# Altium schematic sheet 05 - MCU.SchDoc
size A3; SheetNumber: 5; SheetTotal: 7
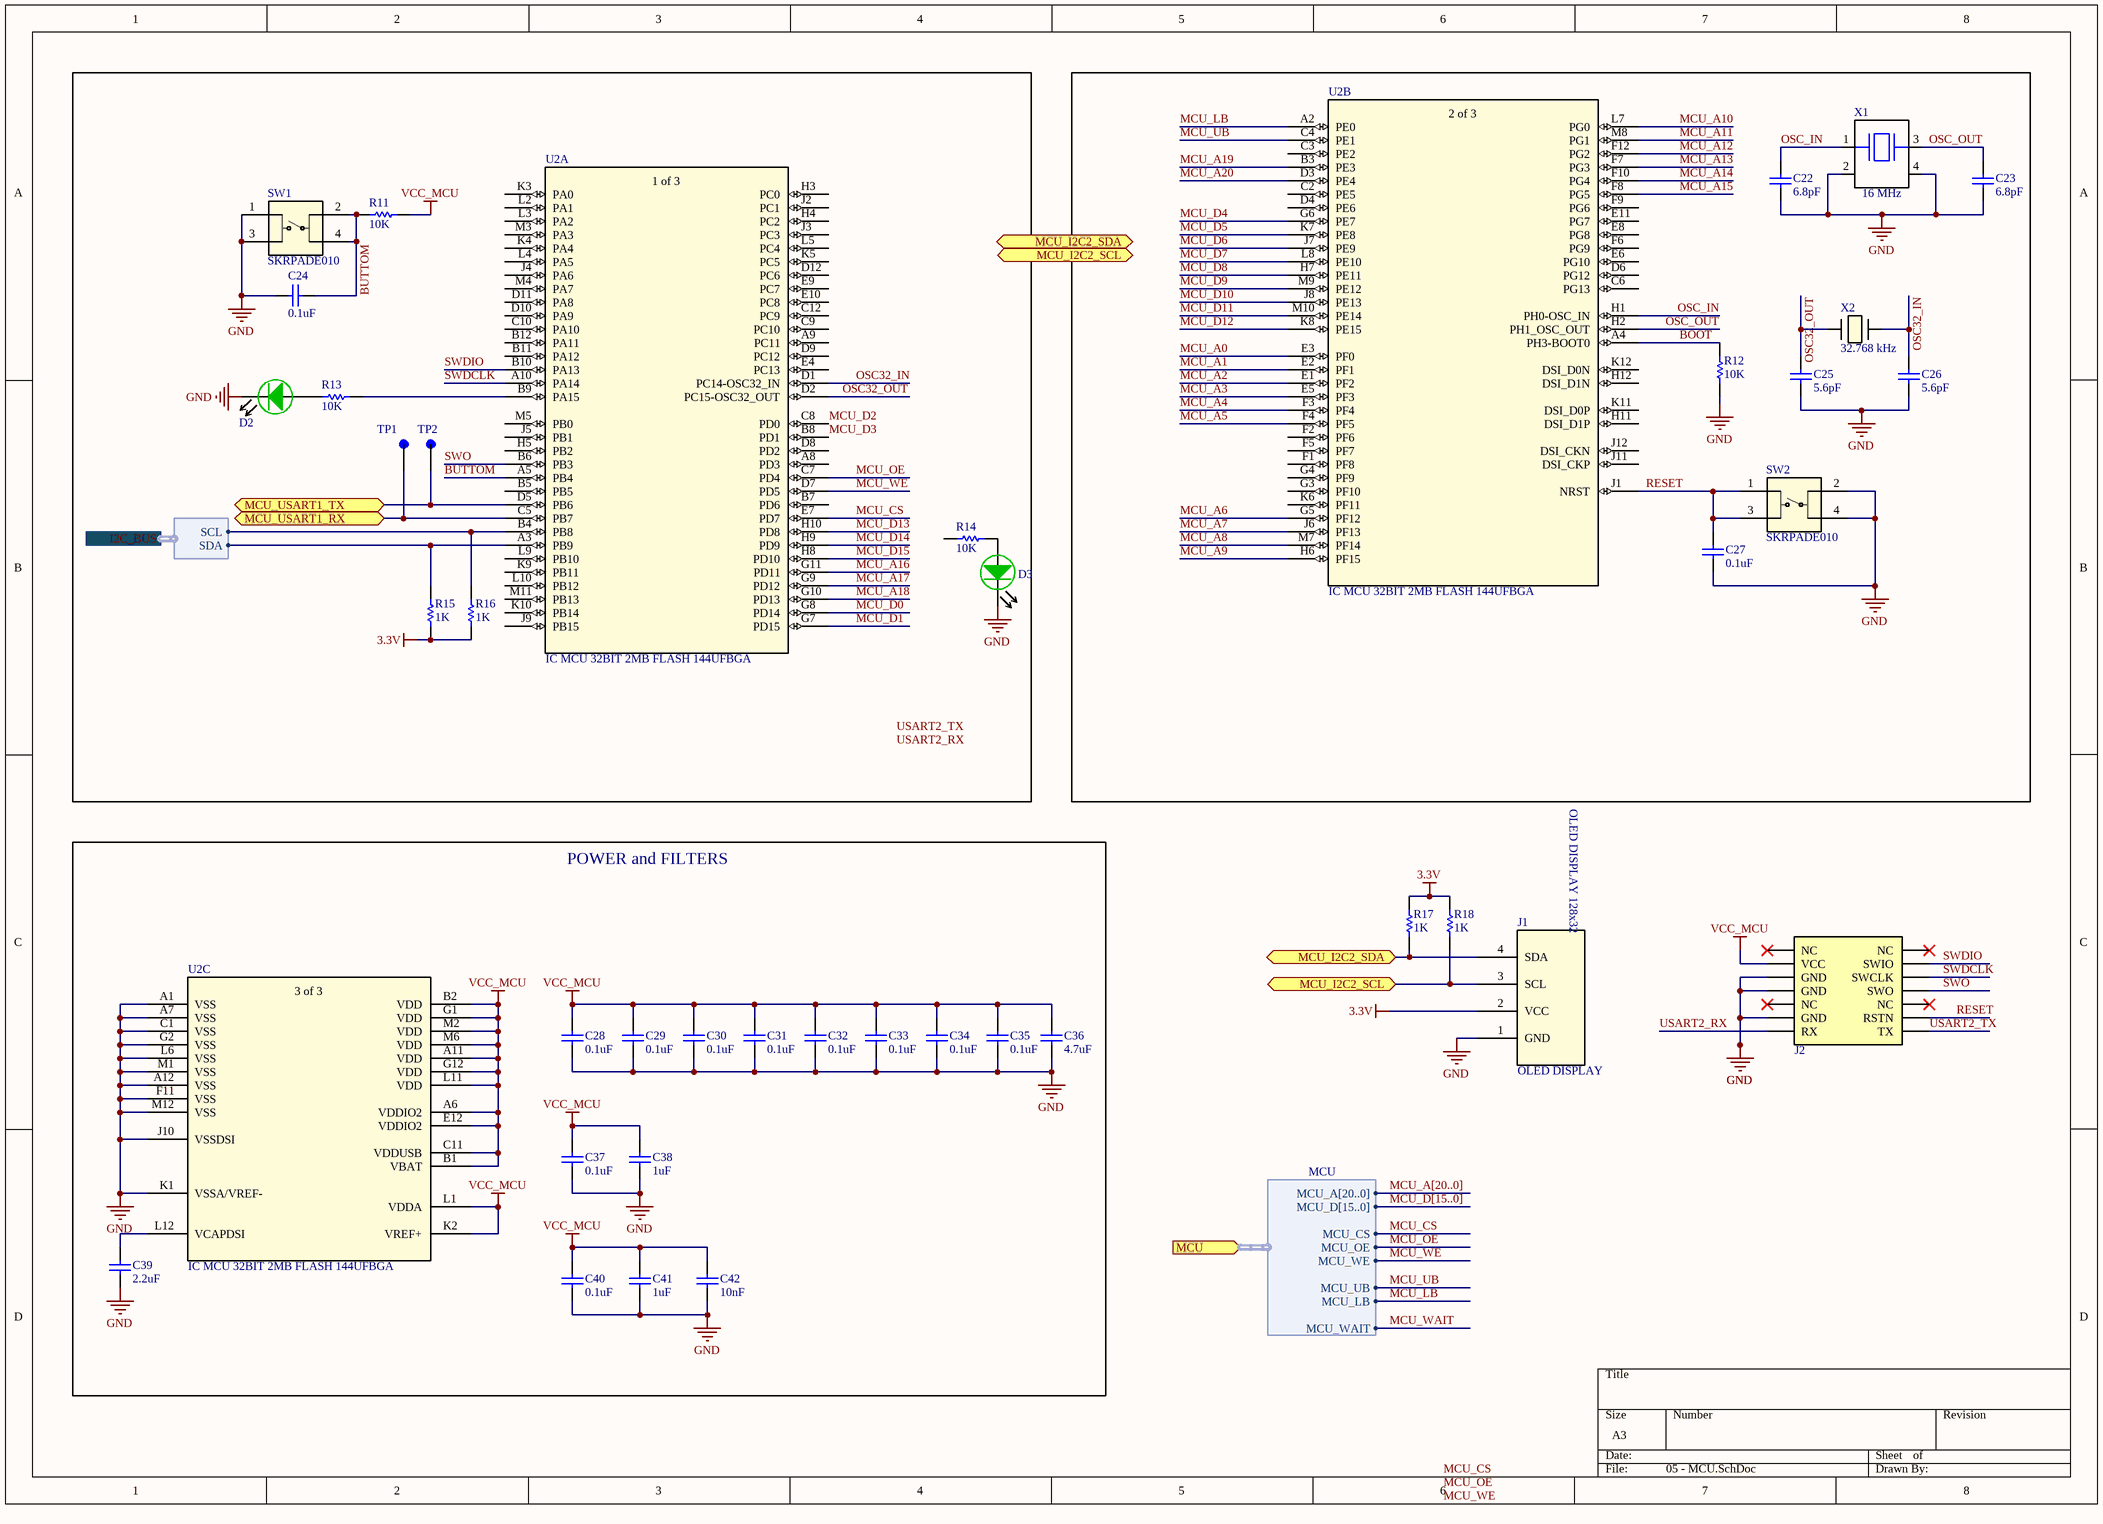
[diagram p0: 05 - MCU.SchDoc]

## Parts
C22  value 6.8pF  [0402-C-R]  (hidden comment: GRM0225C1E6R8CA03L)
C23  value 6.8pF  [0402-C-R]  (hidden comment: GRM0225C1E6R8CA03L)
C24  value 0.1uF  [0402-C-R]  (hidden comment: GRM155R61E104KA87D)
C25  value 5.6pF  [0402-C-R]  (hidden comment: CC0402BRNPO9BN5R6)
C26  value 5.6pF  [0402-C-R]  (hidden comment: CC0402BRNPO9BN5R6)
C27  value 0.1uF  [0402-C-R]  (hidden comment: GRM155R61E104KA87D)
C28  value 0.1uF  [0402-C-R]  (hidden comment: GRM155R61E104KA87D)
C29  value 0.1uF  [0402-C-R]  (hidden comment: GRM155R61E104KA87D)
C30  value 0.1uF  [0402-C-R]  (hidden comment: GRM155R61E104KA87D)
C31  value 0.1uF  [0402-C-R]  (hidden comment: GRM155R61E104KA87D)
C32  value 0.1uF  [0402-C-R]  (hidden comment: GRM155R61E104KA87D)
C33  value 0.1uF  [0402-C-R]  (hidden comment: GRM155R61E104KA87D)
C34  value 0.1uF  [0402-C-R]  (hidden comment: GRM155R61E104KA87D)
C35  value 0.1uF  [0402-C-R]  (hidden comment: GRM155R61E104KA87D)
C36  value 4.7uF  [0402-C-R]  (hidden comment: GRM155D81C475ME15J)
C37  value 0.1uF  [0402-C-R]  (hidden comment: GRM155R61E104KA87D)
C38  value 1uF  [0402-C-R]  (hidden comment: JMK105BJ105KV-F)
C39  value 2.2uF  [0402-C-R]  (hidden comment: 885012105013)
C40  value 0.1uF  [0402-C-R]  (hidden comment: GRM155R61E104KA87D)
C41  value 1uF  [0402-C-R]  (hidden comment: JMK105BJ105KV-F)
C42  value 10nF  [0402-C-R]  (hidden comment: KGM05AR71E103KH)
D2  150060GS75000  [LED0603]  (value not drawn)
D3  150060GS75000  [LED0603]  (value not drawn)
J1  OLED DISPLAY  [OLED_DISPLAY]
J2  CONN HEADER SMD 14POS 1.27MM_1  [SAMTEC_FTSH-107-01-L-DV-K-A]  (value not drawn)
R11  value 10K  [0402-R-R]  (hidden comment: RC0402FR-07560RL)
R12  value 10K  [0402-R-R]  (hidden comment: RC0402FR-0710KL)
R13  value 10K  [0402-R-R]  (hidden comment: RC0402FR-07560RL)
R14  value 10K  [0402-R-R]  (hidden comment: RC0402FR-0710KL)
R15  value 1K  [0402-R-R]  (hidden comment: RC0402FR-071KL)
R16  value 1K  [0402-R-R]  (hidden comment: RC0402FR-071KL)
R17  value 1K  [0402-R-R]  (hidden comment: RC0402FR-071KL)
R18  value 1K  [0402-R-R]  (hidden comment: RC0402FR-071KL)
SW1  SKRPADE010  [SKRPADE010_AAL]
SW2  SKRPADE010  [SKRPADE010_AAL]
TP1  5001  [TEST_POINT]  (value not drawn)
TP2  5001  [TEST_POINT]  (value not drawn)
U2  IC MCU 32BIT 2MB FLASH 144UFBGA  [UFBGA144-10x10mm]  (parts A,B,C of 3)
X1  value 16 MHz  [XTAL_ECS-160-8-33Q-JES-TR]  (hidden comment: STDCRG1-16M)
X2  value 32.768 kHz  [XTAL_NX3215SA_NDK-M - duplicate]  (hidden comment: STDMUA14-32.768K)

## Blocks framed on the sheet
POWER and FILTERS: C28-C42 U2

## Ports
I2C_BUS (harness I2C), MCU (in, harness MCU), MCU_I2C2_SCL (bidir), MCU_I2C2_SDA (bidir), MCU_USART1_RX (bidir), MCU_USART1_TX (bidir)

## Harnesses
I2C: SCL, SDA
MCU: MCU_A[20..0], MCU_D[15..0], MCU_OE, MCU_WE, MCU_CS, MCU_UB, MCU_LB, MCU_WAIT

## Nets
3.3V: J1.2(VCC) R15.2 R16.2 R17.2 R18.2
GND: C22.1 C23.2 C24.2 C25.2 C26.2 C27.1 C28.1 C29.1 C30.1 C31.1 C32.1 C33.1 C34.1 C35.1 C36.1 C37.1 C38.1 C39.1 C40.1 C41.1 C42.1 D2.1(K) D3.1(K) J1.1(GND) J2.05(GND) J2.07(GND) J2.11(GND) R12.1 SW1.1 SW1.3 SW2.2 SW2.4 U2.A1(VSS) U2.A7(VSS) U2.A12(VSS) U2.C1(VSS) U2.F11(VSS) U2.G2(VSS) U2.J10(VSSDSI) U2.K1(VSSA/VREF-) U2.L6(VSS) U2.M1(VSS) U2.M12(VSS) X1.2(GND) X1.4(GND)
VCC_MCU: C28.2 C29.2 C30.2 C31.2 C32.2 C33.2 C34.2 C35.2 C36.2 C37.2 C38.2 C40.2 C41.2 C42.2 J2.03(VCC) R11.1 U2.A6(VDDIO2) U2.A11(VDD) U2.B1(VBAT) U2.B2(VDD) U2.C11(VDDUSB) U2.E12(VDDIO2) U2.G1(VDD) U2.G12(VDD) U2.K2(VREF+) U2.L1(VDDA) U2.L11(VDD) U2.M2(VDD) U2.M6(VDD)
BOOT: R12.2 U2.A4(PH3-BOOT0)
BUTTOM: C24.1 R11.2 SW1.2 SW1.4 U2.A5(PB4)
MCU_A0: U2.E3(PF0)
MCU_A1: U2.E2(PF1)
MCU_A2: U2.E1(PF2)
MCU_A3: U2.E5(PF3)
MCU_A4: U2.F3(PF4)
MCU_A5: U2.F4(PF5)
MCU_A6: U2.G5(PF12)
MCU_A7: U2.J6(PF13)
MCU_A8: U2.M7(PF14)
MCU_A9: U2.H6(PF15)
MCU_A10: U2.L7(PG0)
MCU_A11: U2.M8(PG1)
MCU_A12: U2.F12(PG2)
MCU_A13: U2.F7(PG3)
MCU_A14: U2.F10(PG4)
MCU_A15: U2.F8(PG5)
MCU_A16: U2.G11(PD11)
MCU_A17: U2.G9(PD12)
MCU_A18: U2.G10(PD13)
MCU_A19: U2.B3(PE3)
MCU_A20: U2.D3(PE4)
MCU_CS: U2.E7(PD7) ; port MCU.MCU_CS
MCU_D0: U2.G8(PD14)
MCU_D1: U2.G7(PD15)
MCU_D2: U2.C8(PD0)
MCU_D3: U2.B8(PD1)
MCU_D4: U2.G6(PE7)
MCU_D5: U2.K7(PE8)
MCU_D6: U2.J7(PE9)
MCU_D7: U2.L8(PE10)
MCU_D8: U2.H7(PE11)
MCU_D9: U2.M9(PE12)
MCU_D10: U2.J8(PE13)
MCU_D11: U2.M10(PE14)
MCU_D12: U2.K8(PE15)
MCU_D13: U2.H10(PD8)
MCU_D14: U2.H9(PD9)
MCU_D15: U2.H8(PD10)
MCU_I2C2_SCL: J1.3(SCL) R18.1 ; port MCU_I2C2_SCL
MCU_I2C2_SDA: J1.4(SDA) R17.1 ; port MCU_I2C2_SDA
MCU_LB: U2.A2(PE0) ; port MCU.MCU_LB
MCU_OE: U2.C7(PD4) ; port MCU.MCU_OE
MCU_UB: U2.C4(PE1) ; port MCU.MCU_UB
MCU_USART1_RX: TP1.1 U2.C5(PB7) ; port MCU_USART1_RX
MCU_USART1_TX: TP2.1 U2.D5(PB6) ; port MCU_USART1_TX
MCU_WAIT: port MCU.MCU_WAIT
MCU_WE: U2.D7(PD5) ; port MCU.MCU_WE
OSC32_IN: C26.1 U2.D1(PC14-OSC32_IN) X2.2
OSC32_OUT: C25.1 U2.D2(PC15-OSC32_OUT) X2.1
OSC_IN: C22.2 U2.H1(PH0-OSC_IN) X1.1
OSC_OUT: C23.1 U2.H2(PH1_OSC_OUT) X1.3
RESET: C27.2 J2.12(RSTN) SW2.1 SW2.3 U2.J1(NRST)
SWDCLK: J2.06(SWCLK) U2.A10(PA14)
SWDIO: J2.04(SWIO) U2.B10(PA13)
SWO: J2.08(SWO) U2.B6(PB3)
USART2_RX: J2.13(RX)
USART2_TX: J2.14(TX)
NetC39_2: C39.2 U2.L12(VCAPDSI)
NetD2_2: D2.2(A) R13.2
NetD3_2: D3.2(A) R14.1
NetR13_1: R13.1 U2.B9(PA15)
NetR15_1: R15.1 U2.A3(PB9) ; port I2C_BUS.SDA
NetR16_1: R16.1 U2.B4(PB8) ; port I2C_BUS.SCL

Not connected (* = marked no-connect by the designer): J2 01(NC)* 02(NC)* 09(NC)* 10(NC)*; R14 2; U2 A8(PD3) A9(PC11) B5(PB5) B7(PD6) B11(PA12) B12(PA11) C2(PE5) C3(PE2) C6(PG13) C9(PC10) C10(PA10) C12(PC9) D4(PE6) D6(PG12) D8(PD2) D9(PC12) D10(PA9) D11(PA8) D12(PC6) E4(PC13) E6(PG10) E8(PG8) E9(PC7) E10(PC8) E11(PG7) F1(PF8) F2(PF6) F5(PF7) F6(PG9) F9(PG6) G3(PF10) G4(PF9) H3(PC0) H4(PC2) H5(PB2) H11(DSI_D1P) H12(DSI_D1N) J2(PC1) J3(PC3) J4(PA6) J5(PB1) J9(PB15) J11(DSI_CKP) J12(DSI_CKN) K3(PA0) K4(PA4) K5(PC5) K6(PF11) K9(PB11) K10(PB14) K11(DSI_D0P) K12(DSI_D0N) L2(PA1) L3(PA2) L4(PA5) L5(PC4) L9(PB10) L10(PB12) M3(PA3) M4(PA7) M5(PB0) M11(PB13)

## Buses and harness runs
bus MCU_A[20..0]
bus MCU_D[15..0]

## Notes on the sheet
- Labels drawn without touching a wire or pin: MCU_CS, MCU_OE, MCU_WE, USART2_RX, USART2_TX
- (in symbol IC MCU 32BIT 2MB FLASH 144UFBGA, part A) 1 of 3
- (in symbol IC MCU 32BIT 2MB FLASH 144UFBGA, part B) 2 of 3
- (in symbol IC MCU 32BIT 2MB FLASH 144UFBGA, part C) 3 of 3
- (in symbol OLED DISPLAY) OLED DISPLAY 128x32

## Library data of the parts
C22 C23 = CAP CER 6.8PF 25V C0G/NP0 01005: 6.8 pF ±0.25pF 25V Ceramic Capacitor C0G, NP0 01005 (0402 Metric); TOLERANCE: 5%; SIZE: 0402; VOLTAGE: 25V; PN: GRM0225C1E6R8CA03L
C24 C27-C35 C37 C40 = CAP CER 0.1UF 25V X5R 0402: 0.1 µF ±10% 25V Ceramic Capacitor X5R 0402 (1005 Metric); SIZE: 0402; PN: GRM155R61E104KA87D; VOLTAGE: 25V; TOLERANCE: 10%
C25 C26 = CAP CER 5.6PF 50V C0G/NPO 0402: 5.6 pF ±0.1pF 50V Ceramic Capacitor C0G, NP0 0402 (1005 Metric); TOLERANCE: 1%; SIZE: 0402; VOLTAGE: 50V; PN: CC0402BRNPO9BN5R6
C36 = CAP CER 4.7UF 25V X5R 0402: CAP SMD 0402 MLCC GERAL 4.7uF 25V ±20% 0402 X5s PN: GRM155D81C475ME15J MURATA; SIZE: 0402; VOLTAGE: 25V; TOLERANCE: 20%; PN: GRM155D81C475ME15J
C38 C41 = CAP CER 1UF 6.3V X5R 0402: 1 µF ±10% 6.3V Ceramic Capacitor X5R 0402 (1005 Metric); SIZE: 0402; VOLTAGE: 6.3V; TOLERANCE: 10%; PN: JMK105BJ105KV-F
C39 = CAP CER 2.2UF 10V X5R 0402: 2.2 µF ±20% 10V Ceramic Capacitor X5R 0402 (1005 Metric); SIZE: 0402; VOLTAGE: 10V; TOLERANCE: 20%; PN: 885012105013
C42 = CAP CER 10nF 25V X7R 0402: 10000 pF ±10% 25V Ceramic Capacitor X7R 0402 (1005 Metric); SIZE: 0402; VOLTAGE: 25V; TOLERANCE: 10%; PN: KGM05AR71E103KH
D2 D3 = LED SMD VD 0603: LED SMD VD ALTO BRILHO 1,6x0,8x0,8mm 430mcd PN:150060GS75000 0603 WURTH; ID: ?; PN: 150060GS75000
J2 = CONN HEADER SMD 14POS 1.27MM_1: CONN HEADER SMD 14POS 1.27MM PN: FTSH-107-01-L-DV-K-A; MF: Samtec Inc.; Package: None; Value: *; Price: None; PN: FTSH-107-01-L-DV-K-A; SnapEDA_Link: https://www.snapeda.com/parts/FTSH-107-01-L-DV-K-A/Samtec%20Inc./view-part/2791957/?ref=snap; Availability: Bad
R11 R13 = RES 10K OHM 1% 1/16W 0402: 10 kOhms ±1% 0,063W, 1/16W Resistor de chip 0402 (métrico 1005) Resistente à umidade Filme grosso; PACK: 0402; POWER: 0.063W; PN: RC0402FR-0710KL; TOLERANCE: 1%
R12 R14 = RES 10K OHM 1% 1/16W 0402: 10 kOhms ±1% 0,063W, 1/16W Resistor de chip 0402 (métrico 1005) Resistente à umidade Filme grosso; PACK: 0402; POWER: 0.063W; TOLERANCE: 1%; PN: RC0402FR-0710KL
R15-R18 = RES 1K OHM 1% 1/16W 0402: 1 kOhms ±1% 0.063W, 1/16W Chip Resistor 0402 (1005 Metric) Moisture Resistant Thick Film; PACK: 0402; POWER: 0.063W; TOLERANCE: 1%; PN: RC0402FR-071KL
SW1 SW2 = SWITCH TACTILE SPST-NO 0.05A 16V: Interruptor tátil SPST-NA Top atuado Montagem em superfície; Mfr_Name: Alps Electric; RefDes: RefDes; Type: Type; PN: SKRPADE010
TP1 TP2 = PC TEST POINT MINIATURE BLACK: PC TEST POINT MINIATURE BLACK PN: 5001; MF: Keystone Electronics Corp.; SnapEDA_Link: https://www.snapeda.com/parts/5001/Keystone+Electronics/view-part/?ref=snap; Package: None; Value: *; PN: 5001; Check_prices: https://www.snapeda.com/parts/5001/Keystone+Electronics/view-part/?ref=eda
U2 = IC MCU 32BIT 2MB FLASH 144UFBGA: ARM® Cortex®-M4 STM32L4 Microcontroller IC 32-Bit Single-Core 120MHz 2MB (2M x 8) FLASH 144-UFBGA (10x10) PN: STM32L4R9ZIJ6; Mfr_Name: STMicroelectronics; RefDes: RefDes; Type: Type; PN: STM32L4R9ZIJ6
X1 = CRYSTAL 16.0000MHZ 8PF SMD: 16 MHz ±20ppm Crystal 8pF 80 Ohms 4-SMD, No Lead; SnapEDA_Link: https://www.snapeda.com/parts/ECS-160-8-33Q-JES-TR/ECS/view-part/?ref=snap; Package: ECX-33Q-33Q-4 ECS; PN: STDCRG1-16M
X2 = CRYSTAL 32.7680KHZ 6PF SMD: 32.768 kHz ±20ppm Crystal 6pF 70 kOhms 2-SMD, No Lead; Mfr_Name: NDK; Type: Crystals; PN: STDMUA14-32.768K